# EasyEDA schematic SCH_dial_2026-03-23.json
TITLE: Sheet_1; REV: 1.0; Date: 2026-03-22; Sheet: 1/1; Drawn By: k754a; Company: Your Company
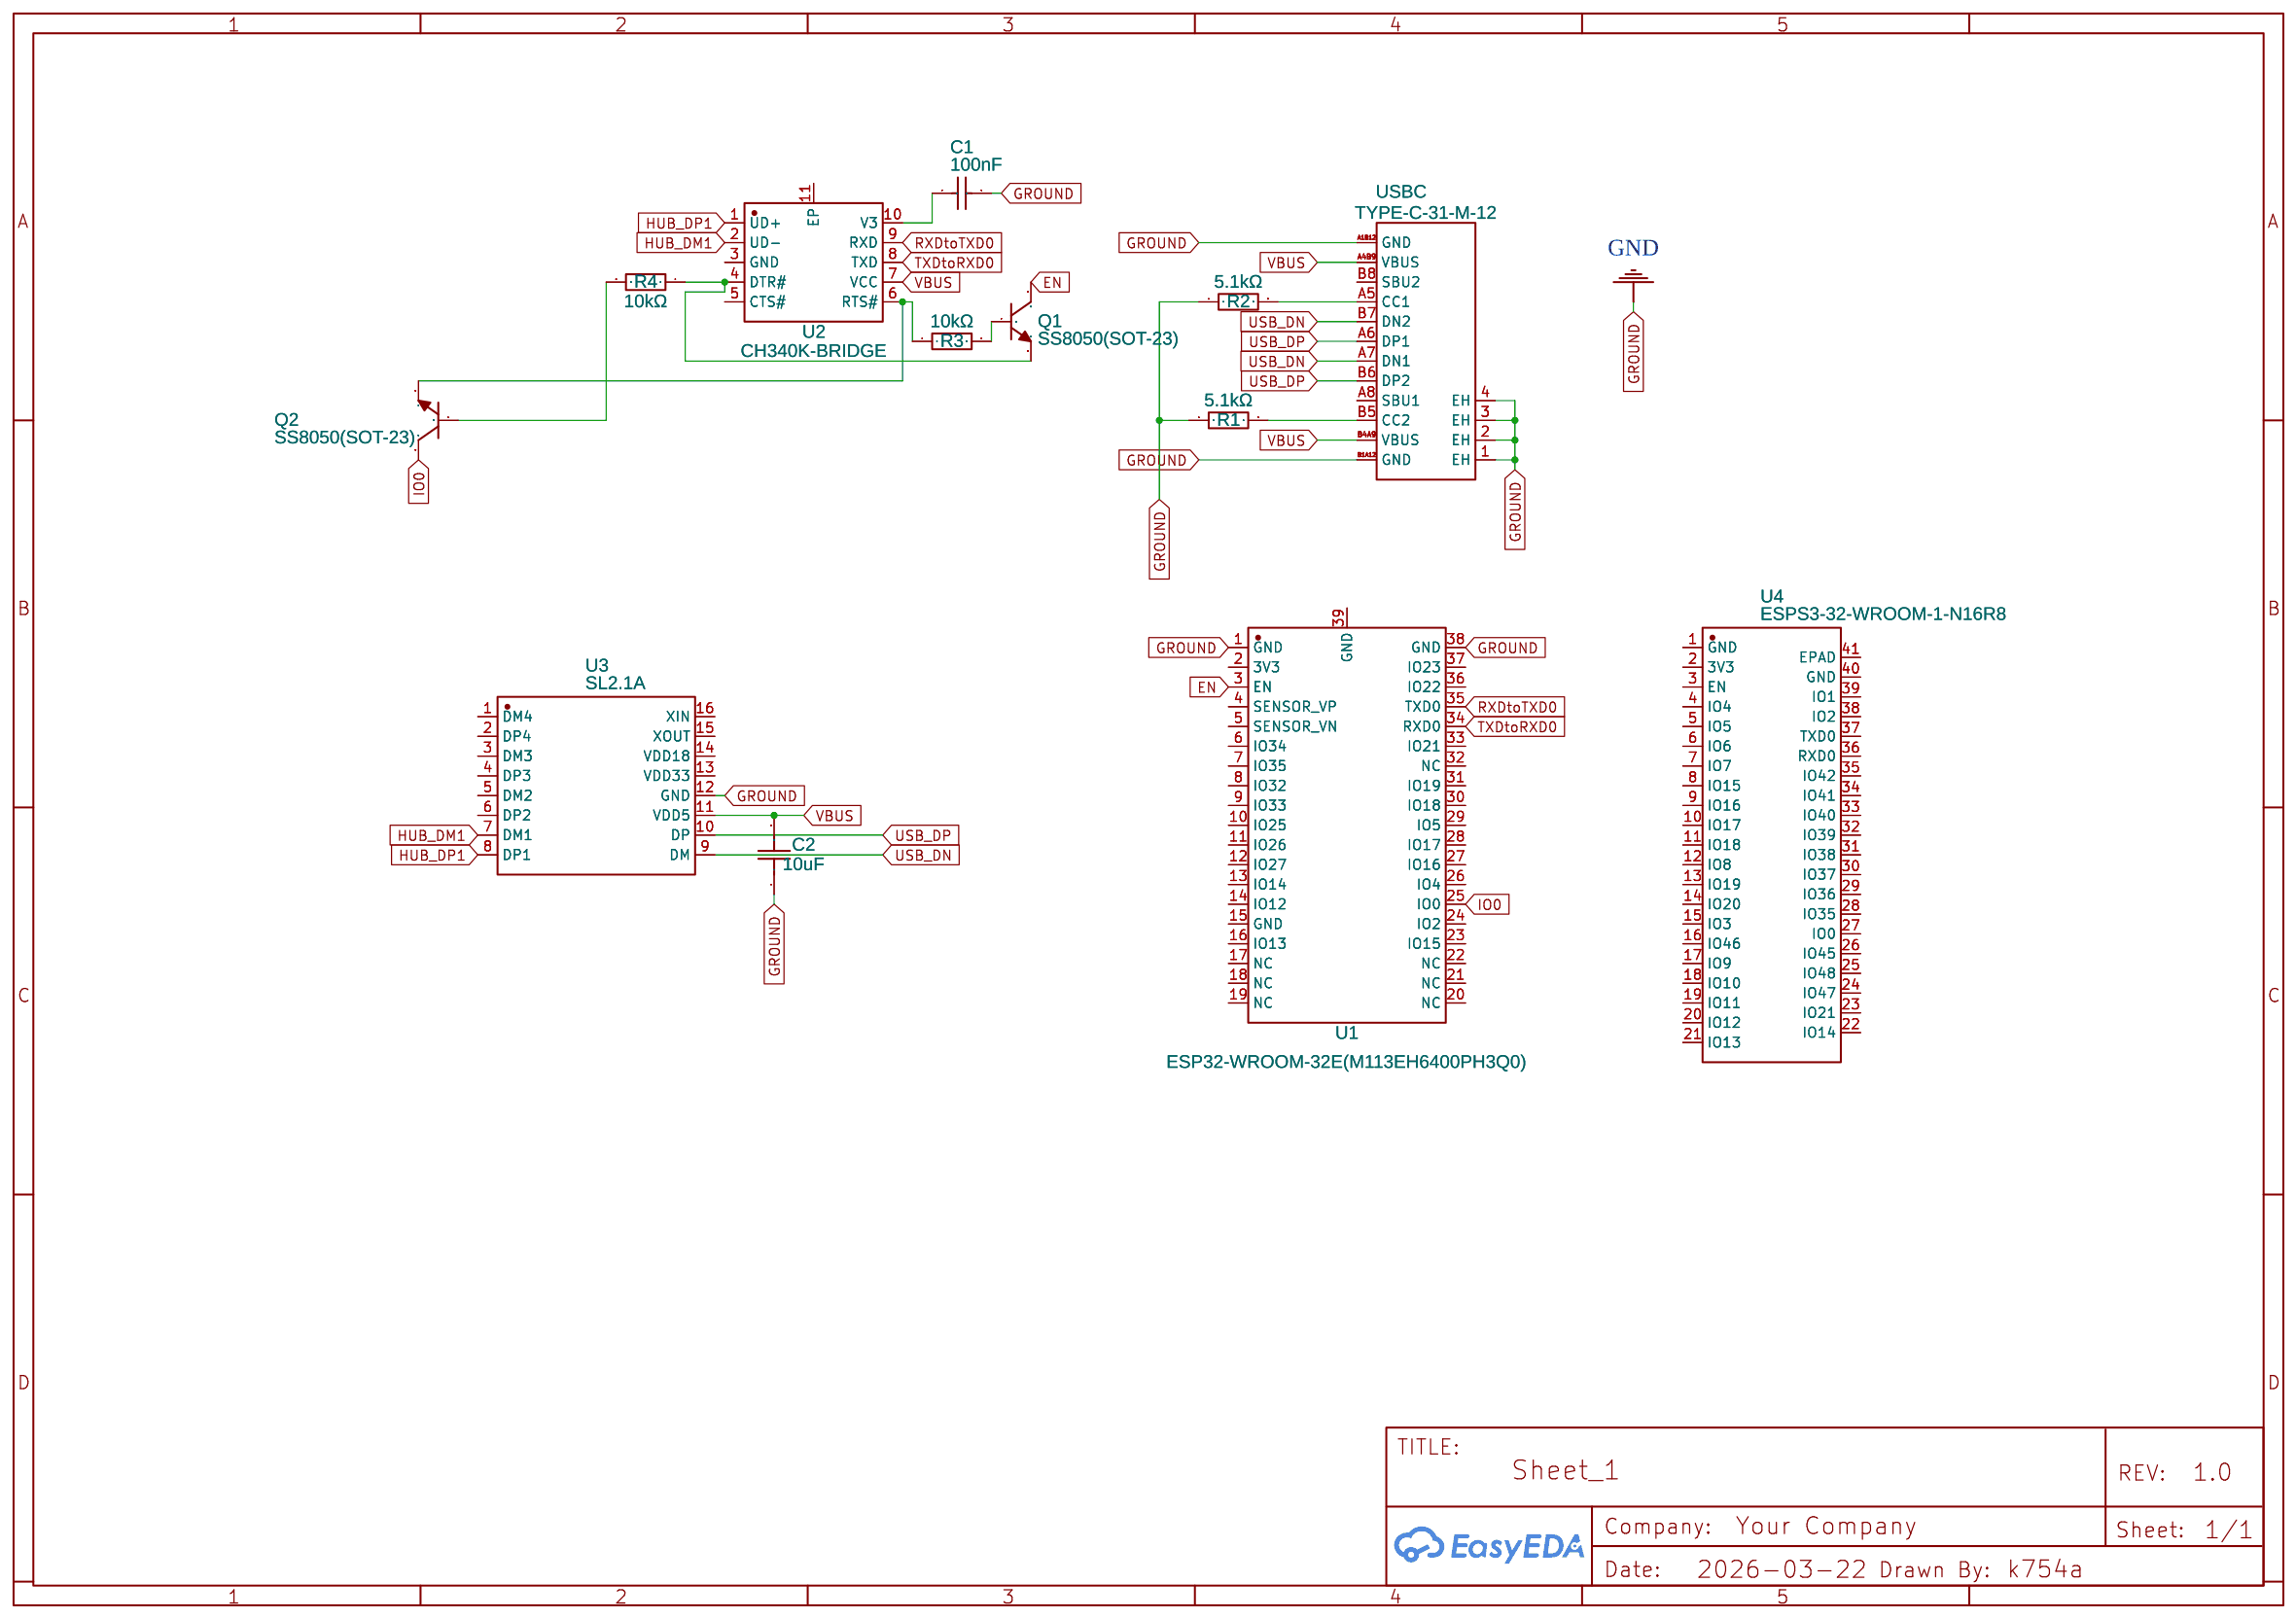
[diagram p0: schematic sheet]

## Parts
C1  100nF  [CAP-TH_L4.9-W3.7-P5.08-D0.5]
C2  10uF  [C0603]
Q1  SS8050(SOT-23)  [SOT-23-3_L2.9-W1.3-P0.95-LS2.4-BR]
Q2  SS8050(SOT-23)  [SOT-23-3_L2.9-W1.3-P0.95-LS2.4-BR]
R1  5.1kΩ  [R0603]
R2  5.1kΩ  [R0603]
R3  10kΩ  [R0204]
R4  10kΩ  [R0204]
U1  ESP32-WROOM-32E(M113EH6400PH3Q0)  [WIFI-SMD_ESP32-WROOM-32E]
U2  CH340K-BRIDGE  [ESOP-10_L4.9-W3.9-P1.00-LS6.2-BL-EP]
U3  SL2.1A  [SOP-16_L10.0-W3.9-P1.27-LS6.0-BL]
U4  ESPS3-32-WROOM-1-N16R8  [WIRELM-SMD_ESP32-S3-WROOM-1]
USBC  TYPE-C-31-M-12  [USB-C_SMD-TYPE-C-31-M-12_1]

## Library data of the parts
C1 = 100nF: Supplier: LCSC; Manufacturer: null; Manufacturer Part: 0.1UF(104) +-20% 63v; Supplier Part: C19355; JLCPCB Part Class: Extended Part
C2 = C0603B106M010T: Supplier: LCSC; Supplier Part: C2998534; Manufacturer: IHHEC(禾伸堂); Contributor: lcsc; JLCPCB Part Class: Extended Part
Q1 Q2 = SS8050(SOT-23): Supplier: LCSC; Supplier Part: C22458785; Manufacturer: ALJ(龙晶微); Contributor: lcsc; JLCPCB Part Class: Extended Part
R1 R2 = RMC06035.1K1%N: Contributor: LCSC; Supplier: LCSC; Supplier Part: C269716; Manufacturer: Tyohm(幸亚电阻); JLCPCB Part Class: Extended Part
R3 R4 = MELF-MFR02041/4WS10KΩFT50: Contributor: LCSC; Supplier: LCSC; Supplier Part: C265133; Manufacturer: Thunder Component(帝谷); JLCPCB Part Class: Extended Part
U1 = ESP32-WROOM-32E(M113EH6400PH3Q0): Supplier: LCSC; Supplier Part: C7274980; Manufacturer: ESPRESSIF(乐鑫); Contributor: lcsc; JLCPCB Part Class: Extended Part
U2 = CH340K: Contributor: LCSC; Supplier: LCSC; Supplier Part: C968586; Manufacturer: WCH(南京沁恒); JLCPCB Part Class: Extended Part
U3 = SL2.1A: Contributor: LCSC; Supplier: LCSC; Supplier Part: C192893; Manufacturer: CoreChips(和芯润德); JLCPCB Part Class: Extended Part
U4 = ESPS3-32-WROOM-1-N16R8: Supplier: LCSC; Supplier Part: C9900209626; Manufacturer: null; JLCPCB Part Class: Extended Part; Contributor: lcsc
USBC = TYPE-C-31-M-12: Contributor: LCSC; Supplier: LCSC; Supplier Part: C165948; Manufacturer: 韩国韩荣; JLCPCB Part Class: Extended Part

## Nets
GND: C1.2 C2.1 R1.1 R2.1 U1.1(GND) U1.38(GND) U3.12(GND) USBC.1(EH) USBC.2(EH) USBC.3(EH) USBC.4(EH) USBC.A1B12(GND) USBC.B1A12(GND)
VBUS: C2.2 U2.7(VCC) U3.11(VDD5) USBC.A4B9(VBUS) USBC.B4A9(VBUS)
EN: Q1.3(C) U1.3(EN)
HUB_DM1: U2.2(UD-) U3.7(DM1)
HUB_DP1: U2.1(UD+) U3.8(DP1)
IO0: Q2.3(C) U1.25(IO0)
RXDtoTXD0: U1.35(TXD0) U2.9(RXD)
TXDtoRXD0: U1.34(RXD0) U2.8(TXD)
USB_DN: U3.9(DM) USBC.A7(DN1) USBC.B7(DN2)
USB_DP: U3.10(DP) USBC.A6(DP1) USBC.B6(DP2)
Net-(C1-1): C1.1 U2.10(V3)
Net-(Q1-1): Q1.1(B) R3.2
Net-(Q1-2): Q1.2(E) R4.1 U2.4(DTR#)
Net-(Q2-1): Q2.1(B) R4.2
Net-(Q2-2): Q2.2(E) R3.1 U2.6(RTS#)
Net-(R1-2): R1.2 USBC.B5(CC2)
Net-(R2-2): R2.2 USBC.A5(CC1)

Not connected (* = marked no-connect by the designer): U1 2(3V3) 4(SENSOR_VP) 5(SENSOR_VN) 6(IO34) 7(IO35) 8(IO32) 9(IO33) 10(IO25) 11(IO26) 12(IO27) 13(IO14) 14(IO12) 15(GND) 16(IO13) 17(NC) 18(NC) 19(NC) 20(NC) 21(NC) 22(NC) 23(IO15) 24(IO2) 26(IO4) 27(IO16) 28(IO17) 29(IO5) 30(IO18) 31(IO19) 32(NC) 33(IO21) 36(IO22) 37(IO23) 39(GND); U2 3(GND) 5(CTS#) 11(EP); U3 1(DM4) 2(DP4) 3(DM3) 4(DP3) 5(DM2) 6(DP2) 13(VDD33) 14(VDD18) 15(XOUT) 16(XIN); U4 1(GND) 2(3V3) 3(EN) 4(IO4) 5(IO5) 6(IO6) 7(IO7) 8(IO15) 9(IO16) 10(IO17) 11(IO18) 12(IO8) 13(IO19) 14(IO20) 15(IO3) 16(IO46) 17(IO9) 18(IO10) 19(IO11) 20(IO12) 21(IO13) 22(IO14) 23(IO21) 24(IO47) 25(IO48) 26(IO45) 27(IO0) 28(IO35) 29(IO36) 30(IO37) 31(IO38) 32(IO39) 33(IO40) 34(IO41) 35(IO42) 36(RXD0) 37(TXD0) 38(IO2) 39(IO1) 40(GND) 41(EPAD); USBC A8(SBU1) B8(SBU2)
